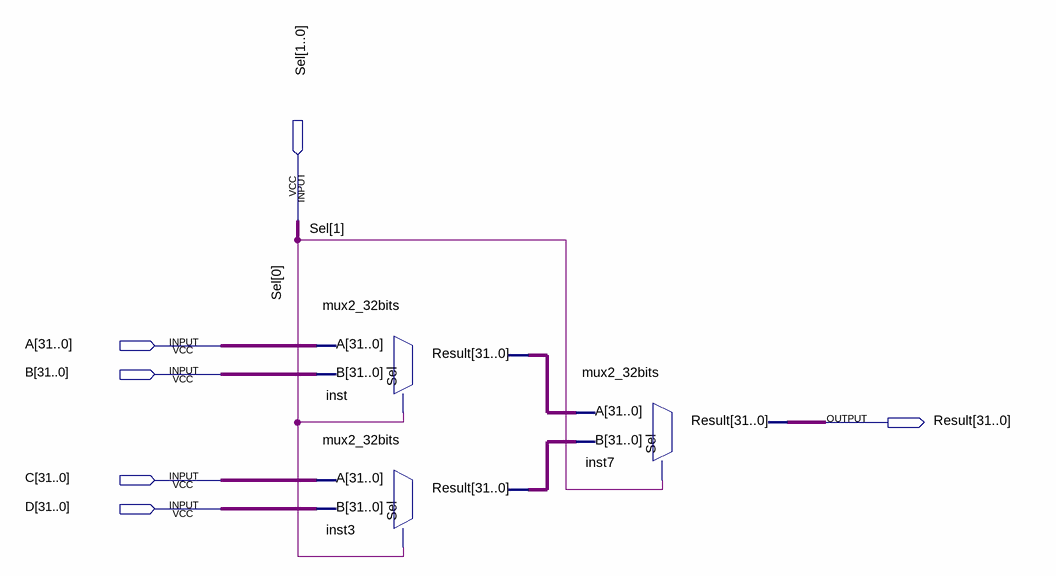
[diagram p0: schematic sheet]
// Quartus schematic mux4_32bits.bdf as structural Verilog: 3 symbols, 6 pins
module mux4_32bits (
  input  [1:0] Sel,
  input  [31:0] A,
  input  [31:0] B,
  input  [31:0] C,
  input  [31:0] D,
  output [31:0] Result
);

  wire [31:0] inst3_result, inst_result;

  mux2_32bits inst (.Sel(Sel[0]), .A(A), .B(B), .Result(inst_result));
  mux2_32bits inst3 (.Sel(Sel[0]), .A(C), .B(D), .Result(inst3_result));
  mux2_32bits inst7 (.Sel(Sel[1]), .A(inst_result), .B(inst3_result), .Result(Result));
endmodule
